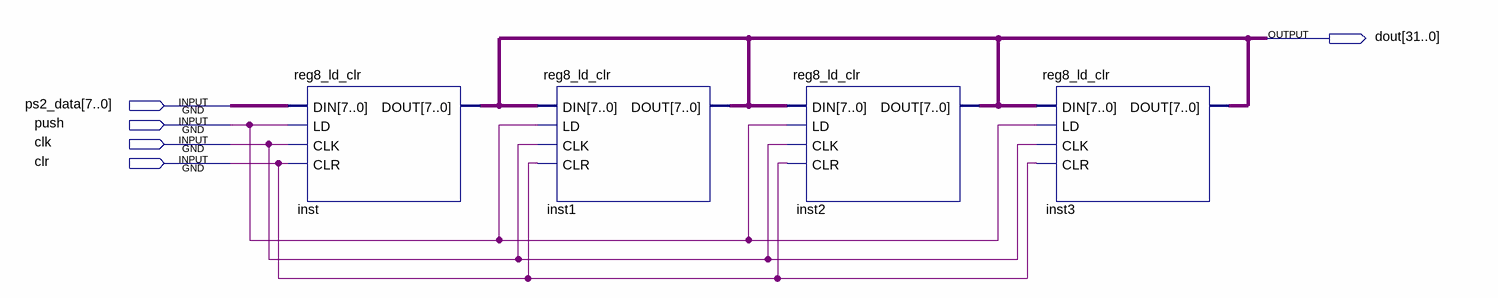
[diagram p0: schematic sheet]
// Quartus schematic ps2_buffer.bdf as structural Verilog: 4 symbols, 5 pins
module ps2_buffer (
  input  [7:0] ps2_data,
  input  push,
  input  clk,
  input  clr,
  output [31:0] dout
);

  reg8_ld_clr inst (.DIN(ps2_data), .LD(push), .CLK(clk), .CLR(clr), .DOUT(dout[31:24]));
  reg8_ld_clr inst1 (.DIN(dout[31:24]), .LD(push), .CLK(clk), .CLR(clr), .DOUT(dout[23:16]));
  reg8_ld_clr inst2 (.DIN(dout[23:16]), .LD(push), .CLK(clk), .CLR(clr), .DOUT(dout[15:8]));
  reg8_ld_clr inst3 (.DIN(dout[15:8]), .LD(push), .CLK(clk), .CLR(clr), .DOUT(dout[7:0]));
endmodule
